# EAGLE schematic HM-10 Breakout (EAGLE 9.5.0)
HM-10 Breakout
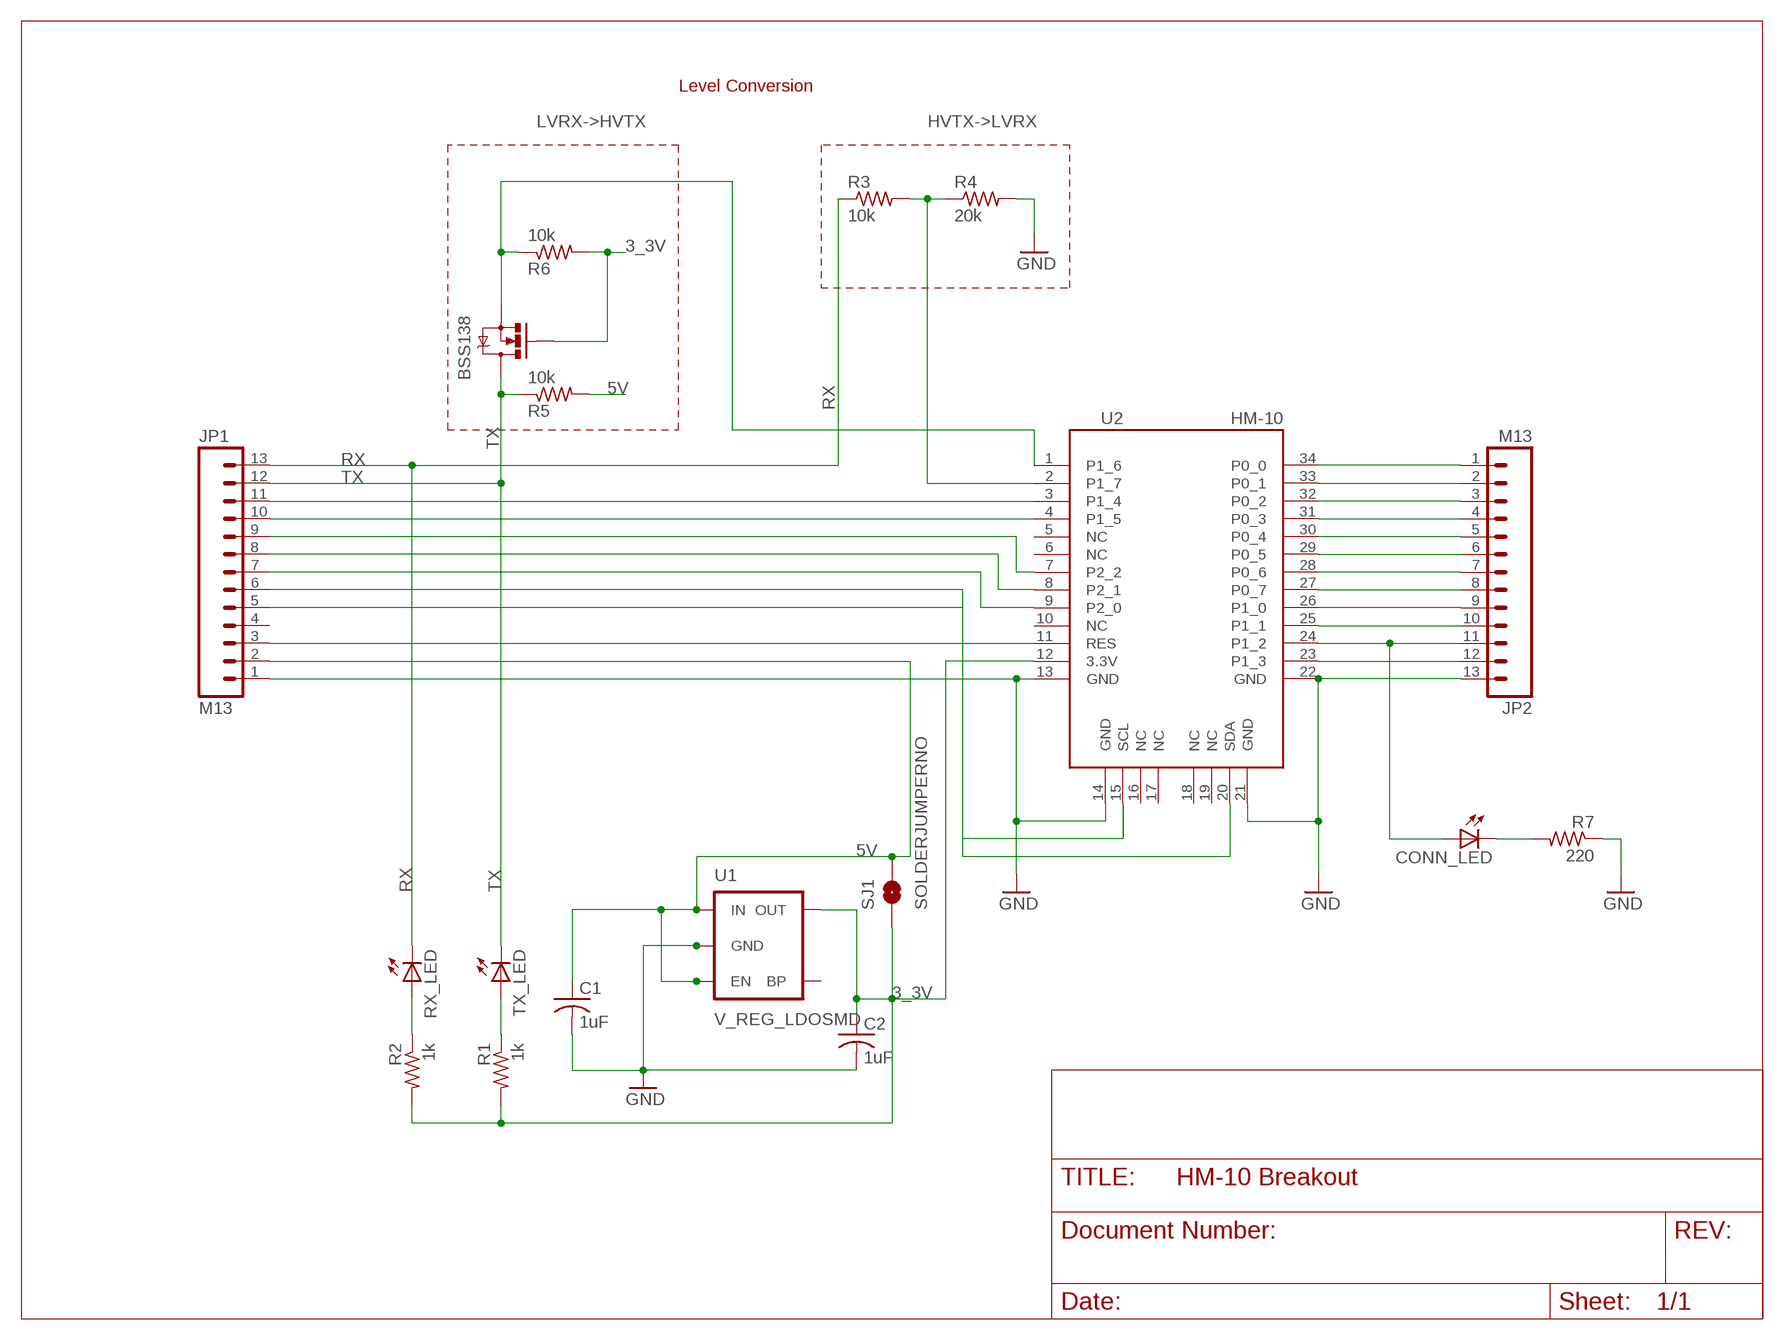
[diagram p0: schematic, sheet 1]

## Parts
BSS138  MOSFET-NCHANNELSMD  [SOT23-3]
C1  1uF  C-USC0805K  [C0805K]
C2  1uF  C-USC0805K  [C0805K]
CONN_LED  LED0603  [LED-0603]
JP1  M13  [1X13]
JP2  M13  [1X13]
R1  1k  R-US_M0805  [M0805]
R2  1k  R-US_M0805  [M0805]
R3  10k  R-US_M0805  [M0805]
R4  20k  R-US_M0805  [M0805]
R5  10k  R-US_M0805  [M0805]
R6  10k  R-US_M0805  [M0805]
R7  220  R-US_M0805  [M0805]
RX_LED  LED0603  [LED-0603]
SJ1  SOLDERJUMPERNO  [SJ_2S-NO]
TX_LED  LED0603  [LED-0603]
U1  V_REG_LDOSMD  [SOT23-5]
U2  HM-10  [HM-10]

## Nets
3_3V: BSS138.1(G) C2.1 R1.2 R2.2 R6.2 SJ1.1 U1.5(OUT) U2.12(3.3V)
5V: C1.1 JP1.2 R5.2 SJ1.2 U1.1(IN) U1.3(EN)
GND: C1.2 C2.2 JP1.1 JP2.13 R4.2 R7.1 U1.2(GND) U2.13(GND) U2.14(GND) U2.21(GND) U2.22(GND)
HVTX->LVRX: R3.2 R4.1 U2.2(P1_7)
LVRX->HVTX: BSS138.2(S) R6.1 U2.1(P1_6)
N$2: CONN_LED.A JP2.11 U2.24(P1_2)
N$3: JP1.3 U2.11(RES)
N$4: JP1.5 U2.15(SCL)
N$5: JP1.9 U2.7(P2_2)
N$6: JP1.8 U2.8(P2_1)
N$7: JP1.7 U2.9(P2_0)
N$8: JP2.10 U2.25(P1_1)
N$9: JP1.6 U2.20(SDA)
N$10: JP1.10 U2.4(P1_5)
N$11: JP1.11 U2.3(P1_4)
N$14: JP2.9 U2.26(P1_0)
N$15: JP2.8 U2.27(P0_7)
N$16: JP2.7 U2.28(P0_6)
N$17: JP2.6 U2.29(P0_5)
N$18: JP2.5 U2.30(P0_4)
N$19: JP2.4 U2.31(P0_3)
N$20: JP2.3 U2.32(P0_2)
N$21: JP2.2 U2.33(P0_1)
N$22: JP2.1 U2.34(P0_0)
N$23: JP2.12 U2.23(P1_3)
N$24: R1.1 TX_LED.A
N$26: CONN_LED.C R7.2
N$27: R2.1 RX_LED.A
RX: JP1.13 R3.1 RX_LED.C
TX: BSS138.3(D) JP1.12 R5.1 TX_LED.C
Unconnected: JP1.4 U1.4(BP) U2.5(NC) U2.6(NC) U2.10(NC) U2.16(NC) U2.17(NC) U2.18(NC) U2.19(NC)

## Notes on the sheet
- Level Conversion

## Library data of the parts
BSS138 = SparkFun:MOSFET-NCHANNEL
C1 C2 = resistor:C-US: CAPACITOR, American symbol
CONN_LED RX_LED TX_LED = SparkFun:LED: LEDs Standard schematic elements and footprints for 5mm, 3mm, 1206, and 0603 sized LEDs. 5mm - Spark Fun Electronics SKU : COM-00529 (and others)
JP1 JP2 = SparkFun:M13
R1-R7 = resistor:R-US_: RESISTOR, American symbol
SJ1 = SparkFun:SOLDERJUMPER: Solder Jumper Standard SMD solder jumper. Used to automate production. Two varients : Normally Open and Normally Closed are the same, but have different paste layers. NC will have a large amount of paste and should jumper during reflow.
U1 = SparkFun:V_REG_LDO: Voltage Regulator LDO Standard 150mA LDO voltage regulator in SOT-23 layout. Micrel part MIC5205. BP (by-pass) pin is used to lower output noise with 470pF cap.
U2 = HM-10_BLE:HM-10